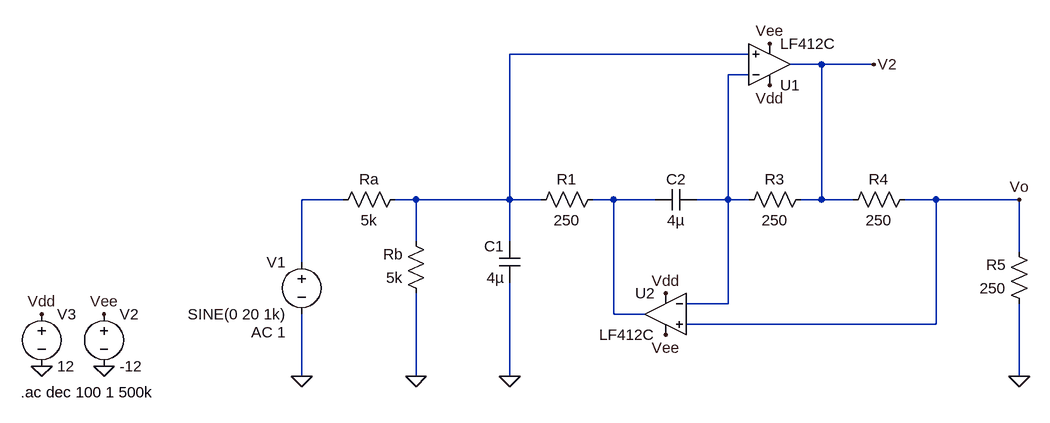
[diagram p0: schematic General_Impedance_Converter.asc]
General_Impedance_Converter.asc, the LTspice schematic file:
Version 4
SHEET 1 1056 680
WIRE 608 -112 240 -112
WIRE 720 -96 672 -96
WIRE 800 -96 720 -96
WIRE 608 -80 576 -80
WIRE -16 112 -80 112
WIRE 96 112 64 112
WIRE 240 112 240 -112
WIRE 240 112 96 112
WIRE 288 112 240 112
WIRE 400 112 368 112
WIRE 464 112 400 112
WIRE 576 112 576 -80
WIRE 576 112 528 112
WIRE 608 112 576 112
WIRE 720 112 720 -96
WIRE 720 112 688 112
WIRE 768 112 720 112
WIRE 896 112 848 112
WIRE 1024 112 896 112
WIRE 96 176 96 112
WIRE 240 176 240 112
WIRE 1024 192 1024 112
WIRE -80 208 -80 112
WIRE 576 272 576 112
WIRE 576 272 512 272
WIRE 400 288 400 112
WIRE 448 288 400 288
WIRE 896 304 896 112
WIRE 896 304 512 304
WIRE -80 384 -80 288
WIRE 96 384 96 256
WIRE 240 384 240 240
WIRE 1024 384 1024 272
FLAG 1024 384 0
FLAG 240 384 0
FLAG 96 384 0
FLAG 800 -96 V2
FLAG -80 384 0
FLAG -480 368 0
FLAG -384 368 0
FLAG -384 288 Vee
FLAG 480 320 Vee
FLAG 640 -128 Vee
FLAG -480 288 Vdd
FLAG 480 256 Vdd
FLAG 640 -64 Vdd
FLAG 1024 112 Vo
SYMBOL res 80 96 R90
WINDOW 0 0 56 VBottom 2
WINDOW 3 32 56 VTop 2
SYMATTR InstName Ra
SYMATTR Value 5k
SYMBOL res 112 272 R180
WINDOW 0 36 76 Left 2
WINDOW 3 36 40 Left 2
SYMATTR InstName Rb
SYMATTR Value 5k
SYMBOL res 272 128 R270
WINDOW 0 32 56 VTop 2
WINDOW 3 0 56 VBottom 2
SYMATTR InstName R1
SYMATTR Value 250
SYMBOL cap 256 240 R180
WINDOW 0 24 56 Left 2
WINDOW 3 24 8 Left 2
SYMATTR InstName C1
SYMATTR Value 4µ
SYMBOL cap 464 128 R270
WINDOW 0 32 32 VTop 2
WINDOW 3 0 32 VBottom 2
SYMATTR InstName C2
SYMATTR Value 4µ
SYMBOL res 704 96 R90
WINDOW 0 0 56 VBottom 2
WINDOW 3 32 56 VTop 2
SYMATTR InstName R3
SYMATTR Value 250
SYMBOL res 864 96 R90
WINDOW 0 0 56 VBottom 2
WINDOW 3 32 56 VTop 2
SYMATTR InstName R4
SYMATTR Value 250
SYMBOL res 1040 288 R180
WINDOW 0 36 76 Left 2
WINDOW 3 36 40 Left 2
SYMATTR InstName R5
SYMATTR Value 250
SYMBOL voltage -80 192 M0
WINDOW 123 24 124 Left 2
WINDOW 39 0 0 Left 0
SYMATTR Value2 AC 1
SYMATTR InstName V1
SYMATTR Value SINE(0 20 1k)
SYMBOL voltage -384 272 R0
WINDOW 123 0 0 Left 0
WINDOW 39 0 0 Left 0
SYMATTR InstName V2
SYMATTR Value -12
SYMBOL voltage -480 272 R0
WINDOW 123 0 0 Left 0
WINDOW 39 0 0 Left 0
SYMATTR InstName V3
SYMATTR Value 12
SYMBOL AutoGenerated\\LF412C 640 -96 M180
SYMATTR InstName U1
SYMBOL AutoGenerated\\LF412C 480 288 M0
SYMATTR InstName U2
TEXT -512 408 Left 2 !.ac dec 100 1 500k

The netlist it stands for:
* General_Impedance_Converter.asc
Ra N001 N003 5k
Rb 0 N001 5k
R1 N001 N004 250
C1 0 N001 4µ
C2 N004 N002 4µ
R3 V2 N002 250
R4 Vo V2 250
R5 0 Vo 250
V1 N003 0 SINE(0 20 1k) AC 1
V2 Vee 0 -12
V3 Vdd 0 12
* U1: LF412C (symbol AutoGenerated\LF412C not available, pins judged from their places): In+=N001 In-=N002 V+=Vdd V-=Vee OUT=V2
* U2: LF412C (symbol AutoGenerated\LF412C not available, pins judged from their places): In+=Vo In-=N002 V+=Vdd V-=Vee OUT=N004
.ac dec 100 1 500k
.backanno
.end